# EAGLE design HeepTeensyBoard (EAGLE 7.3.0)
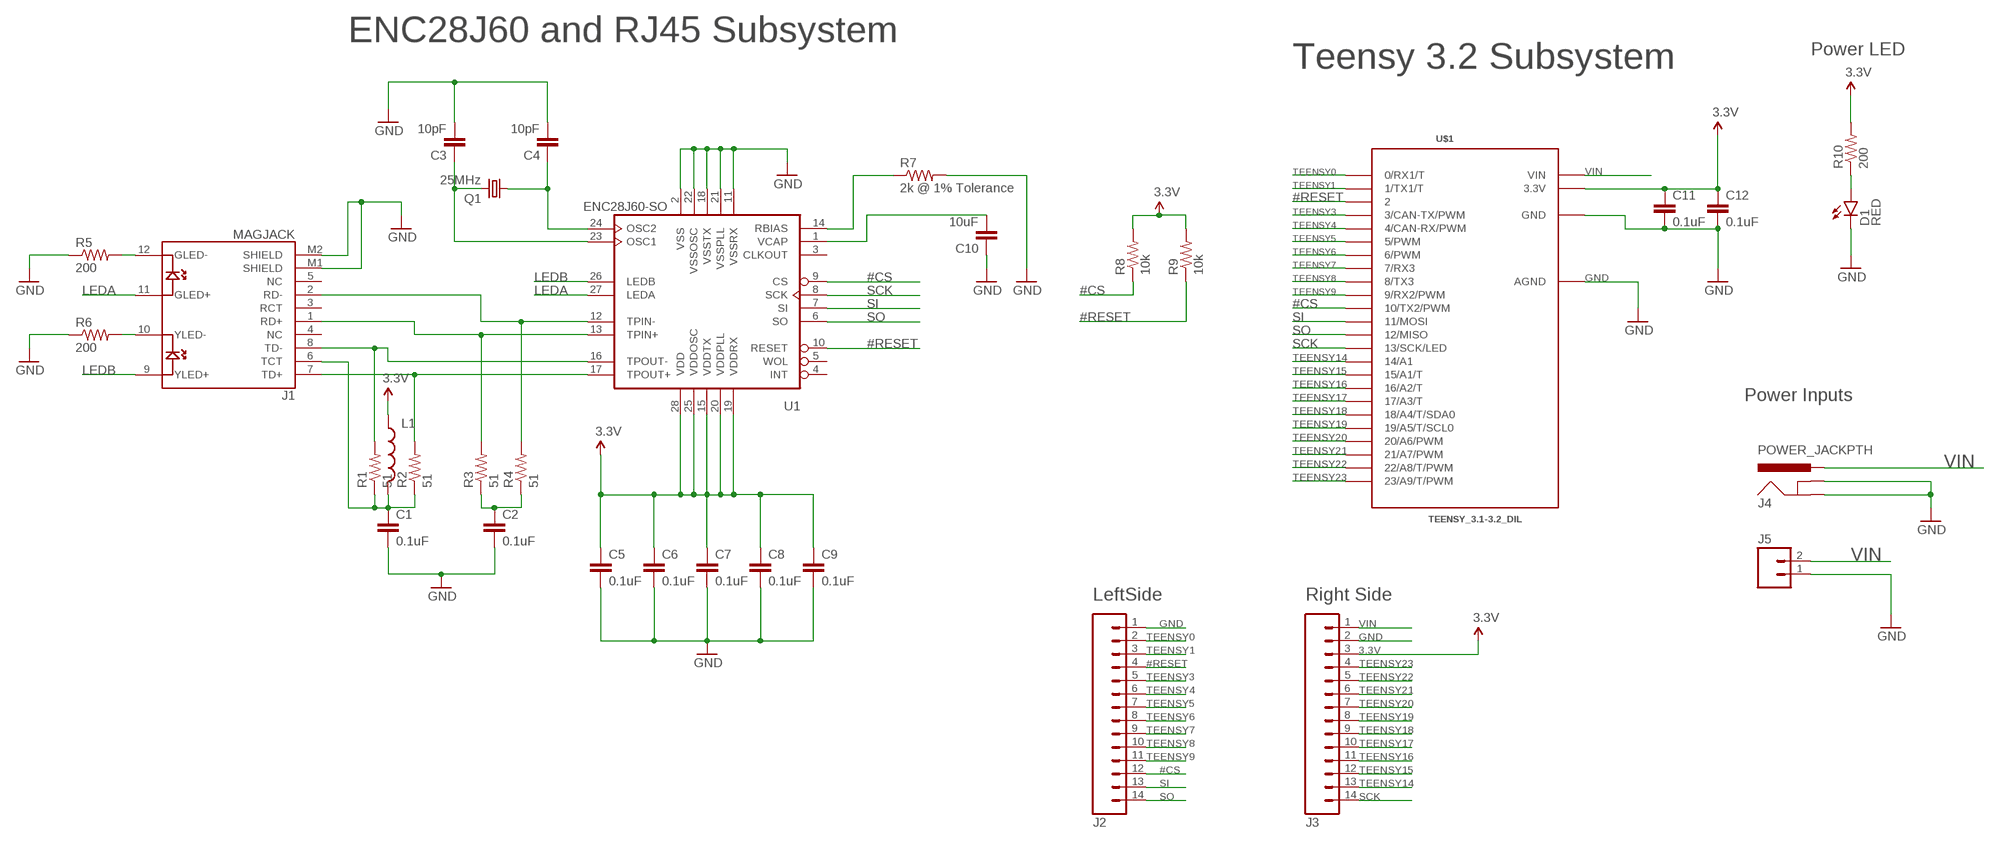
[diagram p0: schematic, sheet 1]

## Parts
C1  0.1uF  CAP0603-CAP  [0603-CAP]
C2  0.1uF  CAP0603-CAP  [0603-CAP]
C3  10pF  CAP0603-CAP  [0603-CAP]
C4  10pF  CAP0603-CAP  [0603-CAP]
C5  0.1uF  CAP0603-CAP  [0603-CAP]
C6  0.1uF  CAP0603-CAP  [0603-CAP]
C7  0.1uF  CAP0603-CAP  [0603-CAP]
C8  0.1uF  CAP0603-CAP  [0603-CAP]
C9  0.1uF  CAP0603-CAP  [0603-CAP]
C10  10uF  CAP0603-CAP  [0603-CAP]
C11  0.1uF  CAP0603-CAP  [0603-CAP]
C12  0.1uF  CAP0603-CAP  [0603-CAP]
D1  RED  LED-RED0603  [LED-0603]
J1  MAGJACK  [MAGJACK]
J2  M14  [1X14]
J3  M14  [1X14]
J4  POWER_JACKPTH  [POWER_JACK_PTH]
J5  M02PTH  [1X02]
L1  INDUCTOR0603  [0603]
Q1  25MHz  CRYSTALSM49  [SM49]
R1  51  RESISTOR0603  [0603-RES]
R2  51  RESISTOR0603  [0603-RES]
R3  51  RESISTOR0603  [0603-RES]
R4  51  RESISTOR0603  [0603-RES]
R5  200  RESISTOR0603  [0603-RES]
R6  200  RESISTOR0603  [0603-RES]
R7  2k @ 1% Tolerance  RESISTOR0603-RES  [0603-RES]
R8  10k  RESISTOR0603-RES  [0603-RES]
R9  10k  RESISTOR0603-RES  [0603-RES]
R10  200  RESISTOR0603-RES  [0603-RES]
U1  ENC28J60-SO  [SO28W]
U$1  TEENSY_3.1-3.2_DIL  [TEENSY_3.0-3.2&LC_DIL]

## Nets
3.3V: C5.1 C6.1 C7.1 C8.1 C9.1 C11.1 C12.1 J3.3 L1.1 R8.2 R9.2 R10.2 U1.15(VDDTX) U1.19(VDDRX) U1.20(VDDPLL) U1.25(VDDOSC) U1.28(VDD) U$1.3.3V
#CS: J2.12 R8.1 U1.9(CS) U$1.10(10/TX2/PWM)
#RESET: J2.4 R9.1 U1.10(RESET) U$1.2
GND: C1.2 C2.2 C3.2 C4.2 C5.2 C6.2 C7.2 C8.2 C9.2 C10.1 C11.2 C12.2 D1.C J1.M1(SHIELD) J1.M2(SHIELD) J2.1 J3.2 J4.GND J4.GNDBREAK J5.1 R5.1 R6.1 R7.2 U1.2(VSS) U1.11(VSSRX) U1.18(VSSTX) U1.21(VSSPLL) U1.22(VSSOSC) U$1.AGND U$1.GND
LEDA: J1.11(GLED+) U1.27(LEDA)
LEDB: J1.9(YLED+) U1.26(LEDB)
N$1: J1.1(RD+) R3.2 U1.13(TPIN+)
N$2: J1.2(RD-) R4.2 U1.12(TPIN-)
N$3: J1.8(TD-) R1.2 U1.16(TPOUT-)
N$4: J1.7(TD+) R2.2 U1.17(TPOUT+)
N$5: C2.1 R3.1 R4.1
N$6: J1.10(YLED-) R6.2
N$7: C1.1 J1.6(TCT) L1.2 R1.1 R2.1
N$8: D1.A R10.1
N$10: J1.12(GLED-) R5.2
N$12: C3.1 Q1.2 U1.23(OSC1)
N$13: C4.1 Q1.1 U1.24(OSC2)
N$15: R7.1 U1.14(RBIAS)
N$17: C10.2 U1.1(VCAP)
SCK: J3.14 U1.8(SCK) U$1.13(13/SCK/LED)
SI: J2.13 U1.7(SI) U$1.11(11/MOSI)
SO: J2.14 U1.6(SO) U$1.12(12/MISO)
TEENSY0: J2.2 U$1.0(0/RX1/T)
TEENSY1: J2.3 U$1.1(1/TX1/T)
TEENSY3: J2.5 U$1.3(3/CAN-TX/PWM)
TEENSY4: J2.6 U$1.4(4/CAN-RX/PWM)
TEENSY5: J2.7 U$1.5(5/PWM)
TEENSY6: J2.8 U$1.6(6/PWM)
TEENSY7: J2.9 U$1.7(7/RX3)
TEENSY8: J2.10 U$1.8(8/TX3)
TEENSY9: J2.11 U$1.9(9/RX2/PWM)
TEENSY14: J3.13 U$1.14/A0(14/A1)
TEENSY15: J3.12 U$1.15/A1(15/A1/T)
TEENSY16: J3.11 U$1.16/A2(16/A2/T)
TEENSY17: J3.10 U$1.17/A3(17/A3/T)
TEENSY18: J3.9 U$1.18/A4(18/A4/T/SDA0)
TEENSY19: J3.8 U$1.19/A5(19/A5/T/SCL0)
TEENSY20: J3.7 U$1.20/A6(20/A6/PWM)
TEENSY21: J3.6 U$1.21/A7(21/A7/PWM)
TEENSY22: J3.5 U$1.22/A8(22/A8/T/PWM)
TEENSY23: J3.4 U$1.23/A9(23/A9/T/PWM)
VIN: J3.1 J4.PWR J5.2 U$1.VIN
Unconnected: J1.3(RCT) J1.4(NC) J1.5(NC) U1.3(CLKOUT) U1.4(INT) U1.5(WOL)

## Notes on the sheet
- ENC28J60 and RJ45 Subsystem
- Power LED
- Teensy 3.2 Subsystem
- Power Inputs
- LeftSide | Right Side

## Library data of the parts
C1 C2 C5-C9 C11 C12 = SparkFun-Capacitors:CAP: Capacitor Standard 0603 ceramic capacitor, and 0.1" leaded capacitor.
C3 C4 C10 = SparkFun-Passives:CAP: Capacitor Standard 0603 ceramic capacitor, and 0.1" leaded capacitor.
D1 = SparkFun-LED:LED-RED: Assorted Red LEDs LilyPad 1206- DIO-09912 1206- DIO-00809 0603- DIO-00819 "SMART" means more efficient and expensive; PROD_ID: DIO-00819
J1 = SparkFun-Connectors:MAGJACK: MAGJACK: RJ-45 with LEDs This is a single port, RJ45 ethernet jacks with built in transformer (magnetics), status LEDs, and shielding. Here is the connector we sell at SparkFun: RJ45 Ethernet MagJack-Compatible <https://www.sparkfun.com/products/8534> (PRT-08534) Datasheet <http://www.sparkfun.com/datasheets/Prototyping/MagJack.pdf> It is used on this SparkFun product: SparkFun RJ45 MagJack Breakout <https://www.sparkfun.com/products/13021> (BOB-13021); PROD_ID: CONN-09556; SF_ID: PRT-08534
J2 J3 = SparkFun-Connectors:M14: Header 14 Standard 14-pin 0.1" header. Use with straight break away headers (SKU : PRT-00116), right angle break away headers (PRT-00553), swiss pins (PRT-00743), machine pins (PRT-00117), and female headers (PRT-00115).
J4 = SparkFun-Connectors:POWER_JACK: Power Jack This is the standard 5.5mm barrel jack for power. The PTH is the most common, proven, reliable, footprint. The Slot footprint only works if the mill layer is transmitted to the PCB fab house so be warned. Mating wall wart : TOL-00298 (and others); PROD_ID: CONN-08197
J5 = SparkFun-Connectors:M02: Standard 2-pin 0.1" header. Use with - straight break away headers ( PRT-00116) - right angle break away headers (PRT-00553) - swiss pins (PRT-00743) - machine pins (PRT-00117) - female headers (PRT-00115) Molex polarized connector foot print use with: PRT-08233 with associated crimp pins and housings. 2.54_SCREWTERM for use with PRT-10571. 3.5mm Screw Terminal footprints for PRT-08084 5mm Screw Terminal footprints for use with PRT-08432
L1 = SparkFun-Passives:INDUCTOR: Inductors Basic Inductor/Choke - 0603 and 1206. Footprints are not proven and vary greatly between part numbers. INDUCTOR POWER 3.3UH 4.0A SMD 0.197" L x 0.197" W x 0.177" H (5.00mm x 5.00mm x 4.50mm)
Q1 = adafruit:CRYSTAL: CRYSTAL; OC_FARNELL: unknown; OC_NEWARK: unknown
R1-R6 = SparkFun-Resistors:RESISTOR: Resistor Basic schematic elements and footprints for 0603, 1206, and PTH resistors.
R7-R10 = SparkFun-Passives:RESISTOR: Resistor Basic schematic elements and footprints for 0603, 1206, and PTH resistors.
U1 = microchip-enc28j60:ENC28J60-*: Microchip 10Mbit Eth. contoller with SPI interface
U$1 = Teensy_3_and_LC_Series_Boards_v1.4:TEENSY_3.1-3.2_DIL: Teensy 3.1 or 3.2 in a DIL Layout.

## Board
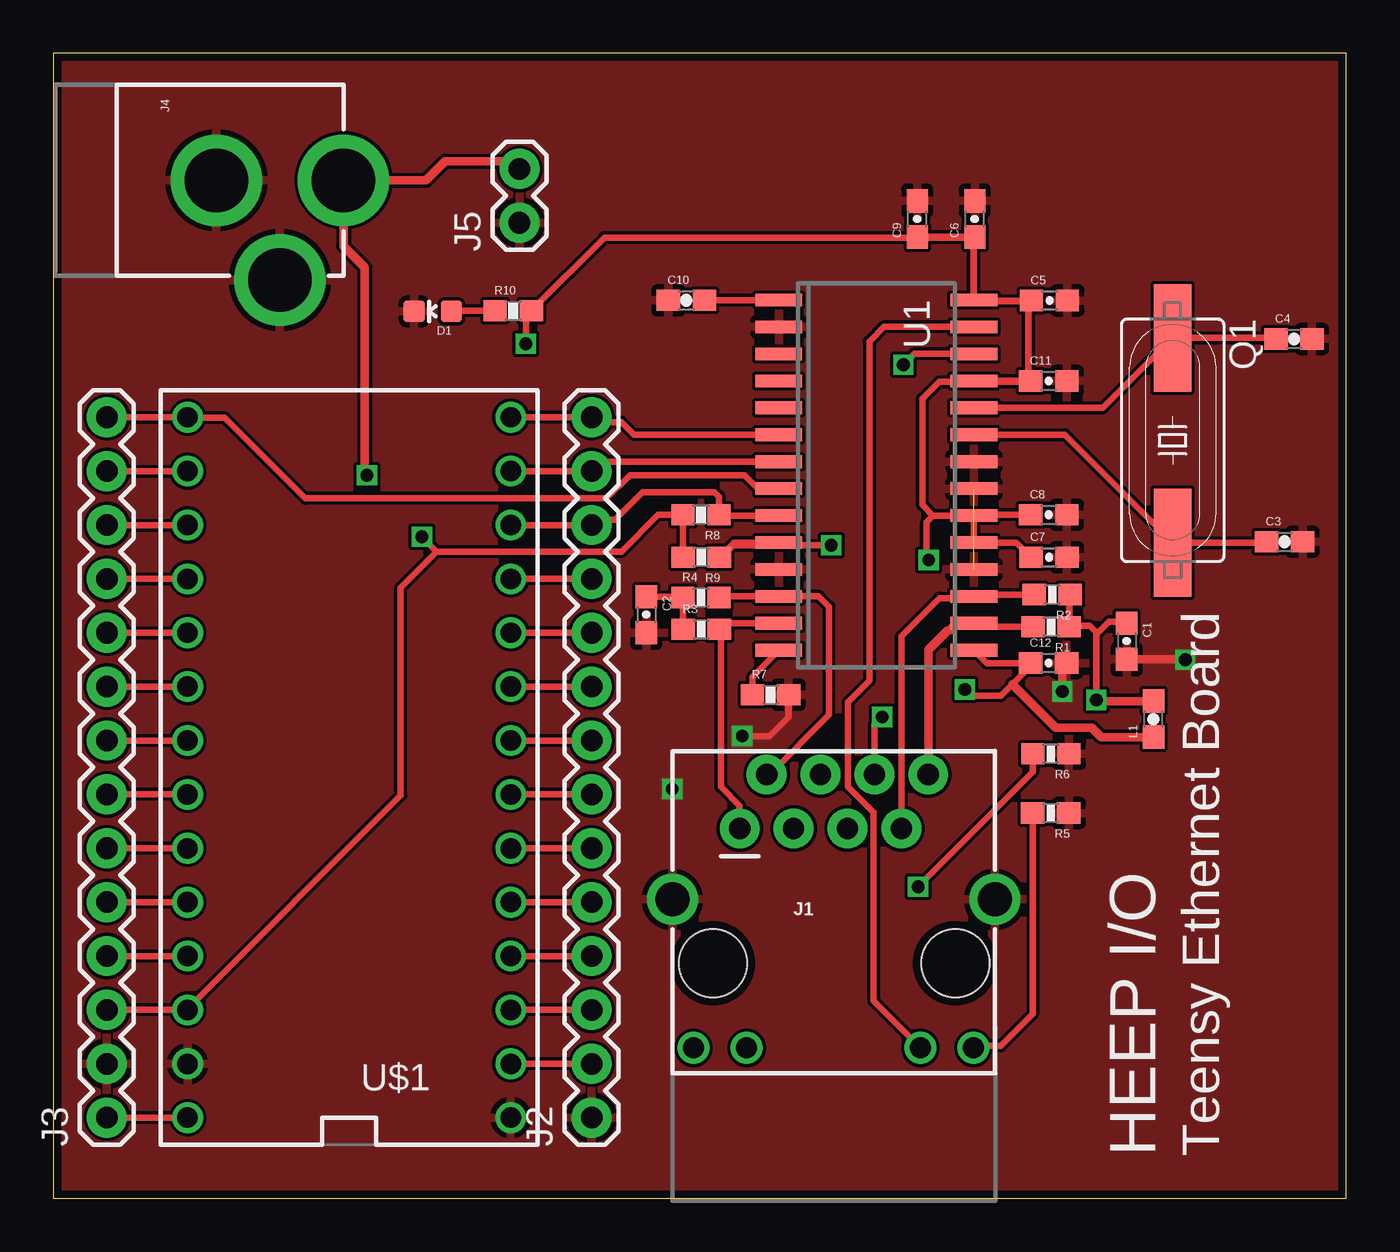
[diagram p1: board, top side]
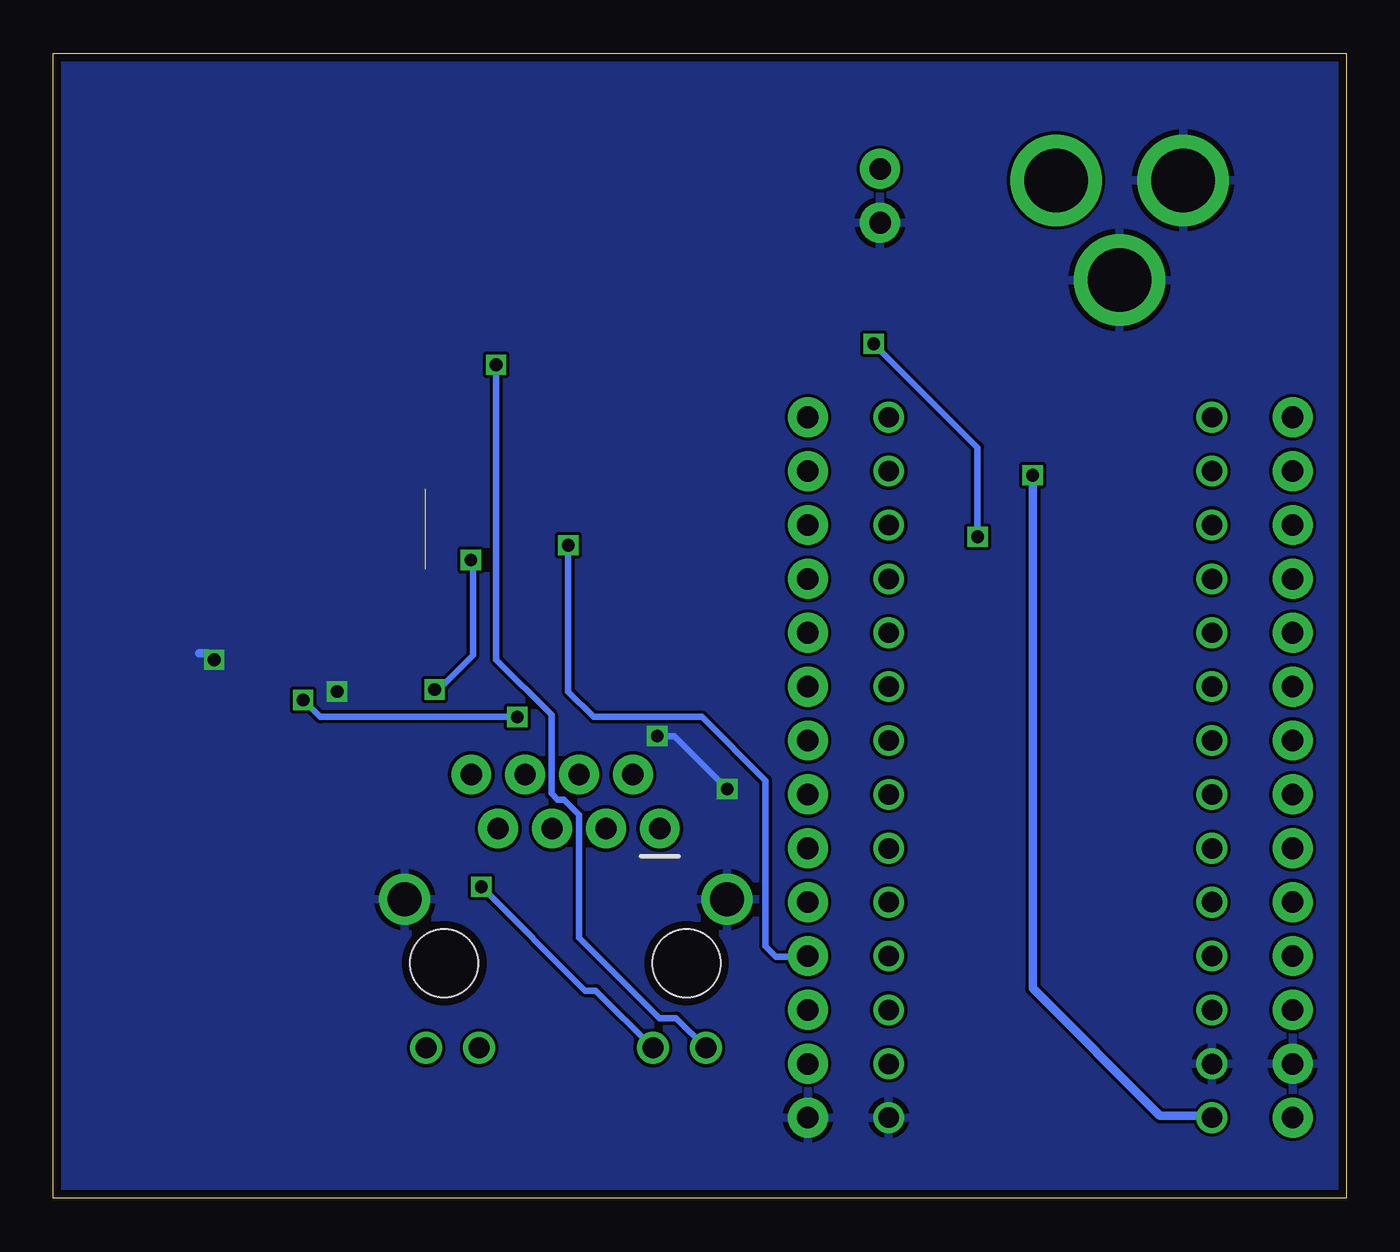
[diagram p2: board, bottom side, seen from below]

Size 61 x 54 mm. Coordinates in mm from the lower left corner, seen from the top.
Outline: 0,0 61,0 61,54 0,54 0,0
Copper layers (1*16): Top 0.0356mm / dielectric 1.5011mm / Bottom 0.0356mm
Design rules "LaenPCBOrder": minimum track width 6mil, minimum drill 13mil, track to track 6mil, track to pad 6mil, pad to pad 6mil, via to via 6mil, smd to smd 6mil, copper to edge 15mil, drill to drill 6mil, minimum pad ring 7mil, minimum via ring 7mil, stop-mask expansion 3mil, vias tented up to drill 0mil, thermal gap 10mil

### Footprints (pad centres in the part's own frame; a part is rotated, then mirrored left to right if it is on the bottom)
0603-CAP = smd 1.1 x 1: 1 -0.85,0; 2 0.85,0
LED-0603 = smd 1 x 1: A 0,-0.877; C 0,0.877
MAGJACK = drill 1 pad 1.88: 1 3.175,17.445; 2 4.445,19.985; 3 5.715,17.445; 4 6.985,19.985; 5 8.255,17.445; 6 9.525,19.985; 7 10.795,17.445; 8 12.065,19.985 | drill 1 pad 1.27: 9 1,7.1; 10 3.5,7.1; 11 11.7,7.1; 12 14.2,7.1 | drill 1.6 pad 2.184: M1 0,14.1; M2 15.2,14.1 | hole 3.2: 1.905,11.095; 13.335,11.095
1X14 = drill 1.016 pad 1.88: 1 0,0; 2 2.54,0; 3 5.08,0; 4 7.62,0; 5 10.16,0; 6 12.7,0; 7 15.24,0; 8 17.78,0; 9 20.32,0; 10 22.86,0; 11 25.4,0; 12 27.94,0; 13 30.48,0; 14 33.02,0
POWER_JACK_PTH = drill 2.997 pad 4.318: GND 0,7.7; GNDBREAK 4.7,10.7; PWR 0,13.7
1X02 = drill 1.016 pad 1.88: 1 0,0; 2 2.54,0
0603 = smd 1.1 x 1: 1 -0.85,0; 2 0.85,0
SM49 = smd 5.08 x 1.778: 1 -4.826,0; 2 4.826,0
0603-RES = smd 1.1 x 1: 1 -0.85,0; 2 0.85,0
SO28W = smd 0.6 x 2.2: 1 -8.255,-4.6; 2 -6.985,-4.6; 3 -5.715,-4.6; 4 -4.445,-4.6; 5 -3.175,-4.6; 6 -1.905,-4.6; 7 -0.635,-4.6; 8 0.635,-4.6; 9 1.905,-4.6; 10 3.175,-4.6; 11 4.445,-4.6; 12 5.715,-4.6; 13 6.985,-4.6; 14 8.255,-4.6; 15 8.255,4.6; 16 6.985,4.6; 17 5.715,4.6; 18 4.445,4.6; 19 3.175,4.6; 20 1.905,4.6; 21 0.635,4.6; 22 -0.635,4.6; 23 -1.905,4.6; 24 -3.175,4.6; 25 -4.445,4.6; 26 -5.715,4.6; 27 -6.985,4.6; 28 -8.255,4.6
TEENSY_3.0-3.2&LC_DIL = drill 0.965: 0 -7.62,13.97; 1 -7.62,11.43; 2 -7.62,8.89; 3 -7.62,6.35; 3.3V 7.62,11.43; 4 -7.62,3.81; 5 -7.62,1.27; 6 -7.62,-1.27; 7 -7.62,-3.81; 8 -7.62,-6.35; 9 -7.62,-8.89; 10 -7.62,-11.43; 11 -7.62,-13.97; 12 -7.62,-16.51; 13 7.62,-16.51; 14/A0 7.62,-13.97; 15/A1 7.62,-11.43; 16/A2 7.62,-8.89; 17/A3 7.62,-6.35; 18/A4 7.62,-3.81; 19/A5 7.62,-1.27; 20/A6 7.62,1.27; 21/A7 7.62,3.81; 22/A8 7.62,6.35; 23/A9 7.62,8.89; AGND 7.62,13.97; GND -7.62,16.51; VIN 7.62,16.51

### Placement (x,y rotation side)
C1  50.63,26.27 270 top
C2  27.98,27.52 270 top
C3  58.08,30.96 0 top
C4  58.52,40.52 0 top
C5  46.99,42.33 0 top
C6  43.47,46.18 90 top
C7  46.97,30.23 0 top
C8  46.96,32.23 0 top
C9  40.76,46.18 90 top
C10  29.87,42.34 0 top
C11  46.96,38.54 0 top
C12  46.95,25.24 0 top
D1  17.91,41.82 90 top
J1  29.21,0 0 top
J2  25.4,3.81 90 top
J3  2.54,3.81 90 top
J4  0,48 270 top
J5  22,46 90 top
L1  51.9,22.6 90 top
Q1  52.8,35.74 270 top
R1  47.07,26.95 180 top
R2  47.12,28.47 180 top
R3  30.57,26.83 0 top
R4  30.56,28.33 0 top
R5  47.05,18.17 180 top
R6  47.06,20.97 180 top
R7  33.84,23.75 0 top
R8  30.56,32.23 180 top
R9  30.57,30.23 180 top
R10  21.7,41.85 0 top
U1  38.83,34.1 270 top
U$1  13.97,20.32 180 top

### Tracks (layer width: path | path; a pad name or v marks a point on that pad's centre or on a via)
3.3V  (via drill 0.6)
  Top 0.305: R9.2 R8.2 28.53,32.23 26.8,30.5 18.1,30.5 | U1.15 44.03,25.24 C12.1 46.1,25.1 45.25,24.25 44.7,23.7 43.3,23.7 v43,24 | C8.1 43.47,32.23 U1.20 | C7.1 45.42,30.93 U1.19 U1.20 | C5.1 45.87,42.33 | C9.1 C6.1 43.43,45.29 U1.28 43.45,42.33 45.87,42.33 | 45.87,42.33 46,42.2 46,38.65 C11.1 U1.25 43.38,38.5 | U1.20 41.51,32.2 | 41.51,32.2 41,32.7 41,37.7 41.8,38.5 43.38,38.5 | v41.3,30.1 41.3,30.3 41.2,30.4 41.2,31.89 41.51,32.2 | J3.3 U$1.3.3V 6.35,8.95 16.4,19 16.4,28.8 18.1,30.5 | 18.1,30.5 v17.4,31.2 | v22.3,40.3 22.3,41.6 R10.2 26,45.3 43.5,45.3 43.4,45.2 43.4,42.4 43.5,42.3 46,42.3 46,38.5 43.38,38.5
  Top 0.406: L1.1 49.45,21.75 49,22.2 47.3,22.2 45.25,24.25
  Bottom 0.305: v43,24 42.8,24 41.2,25.6 41.2,30 v41.3,30.1 | v17.4,31.2 17.4,35.4 v22.3,40.3
#CS
  Top 0.305: U1.9 31.45,32.2 R8.1 31.41,33.09 31.2,33.3 27.8,33.3 26.5,32 25.65,32 J2.12 U$1.10
#RESET  (via drill 0.6)
  Top 0.305: U1.10 32.12,30.93 R9.1 31.42,30.02 31.3,29.9 31.3,30 32.1,30.8 v36.7,30.8 | J2.4 U$1.2
  Bottom 0.305: v36.7,30.8 36.7,23.9 35.5,22.7 30.4,22.7 27.4,19.7 27.4,11.9 26.9,11.4 25.43,11.4 J2.4
GND  (via drill 0.6)  (1 unrouted)
  Top 0.305: U1.11 33.85,29.66 33.8,29.6 | R7.2 34.69,22.69 33.8,21.8 v32.5,21.8 | v29.2,19.3 29,19.3
  Top 0.406: C1.2 53.38,25.42 v53.4,25.4 | C12.2 47.6,25.04 v47.6,23.9
  Bottom 0.305: v32.5,21.8 31.7,21.8 v29.2,19.3
  Bottom 0.406: v53.4,25.4 53.7,25.7 54.1,25.7 | v47.6,23.9 47.6,23.7
  pour Top: -8,86 108,86 108,37 108,-5 -17,-5 -17,86
  pour Bottom: -15,59 74,59 74,8 74,-4 -15,-4
LEDA
  Top 0.305: U1.27 39.19,41.09 38.5,40.4 38.5,24.4 37.5,23.4 37.5,19.4 38.7,18.2 38.7,9.31 J1.11
LEDB  (via drill 0.6)
  Top 0.305: U1.26 40.62,39.81 v40.1,39.3
  Bottom 0.305: v40.1,39.3 40.1,25.4 37.5,22.8 37.5,19.1 37.2,18.8 36.9,18.8 36.2,18.1 36.2,12.3 32.4,8.5 31.61,8.5 J1.9
N$1
  Top 0.305: J1.1 32.38,18.52 31.5,19.4 31.5,26.75 R3.2 31.7,27.11 U1.13
N$2
  Top 0.305: J1.2 33.78,19.98 36.6,22.8 36.6,27.9 36.1,28.4 34.24,28.4 U1.12 31.46,28.39 R4.2
N$3
  Top 0.305: R1.2 43.59,26.95 U1.16
  Top 0.406: J1.8 41.27,25.88 42.2,26.8 42.3,26.8 42.6,27.1 43.41,27.1 U1.16
N$4
  Top 0.305: J1.7 40.01,26.5 41.8,28.3 43.34,28.3 U1.17 43.52,28.47 R2.2
N$5
  Top 0.305: C2.1 29.67,28.37 R4.1 R3.1
N$6  (via drill 0.6)
  Top 0.305: R6.2 46.21,20.11 v40.8,14.7
  Bottom 0.305: v40.8,14.7 35.9,9.8 35.41,9.8 J1.10
N$7  (via drill 0.6)
  Top 0.305: J1.6 38.73,22.34 v39.1,22.7 | v49.2,23.5 49.2,26.7 | 49.2,26.7 48.9,27 47.97,27 R1.1 47.92,28.42 R2.1 | 49.2,26.7 49.3,26.7 49.8,27.2 50.55,27.2 C1.1
  Top 0.406: L1.2 49.2,23.45 v49.2,23.5
  Bottom 0.305: v39.1,22.7 48.4,22.7 v49.2,23.5
N$8
  Top 0.305: R10.1 18.82,41.85 D1.A
N$10
  Top 0.305: R5.2 46.2,8.7 44.7,7.2 43.51,7.2 J1.12
N$12
  Top 0.305: U1.23 47.71,36.01 Q1.2 57.18,30.91 C3.1
N$13
  Top 0.305: U1.24 49.51,37.27 Q1.1 57.62,40.57 C4.1
N$15
  Top 0.305: R7.1 32.99,24.61 U1.14
N$17
  Top 0.305: U1.1 30.73,42.35 C10.2
SCK
  Top 0.305: U1.8 33.23,33.47 32.6,34.1 27.2,34.1 26.1,33 11.9,33 8.1,36.8 6.38,36.8 U$1.13 J3.14
SI
  Top 0.305: U1.7 25.84,34.73 J2.13 U$1.11
SO
  Top 0.305: U1.6 27.39,36.01 26.8,36.6 25.63,36.6 J2.14 U$1.12
TEENSY0
  Top 0.305: J2.2 U$1.0
TEENSY1
  Top 0.305: J2.3 U$1.1
TEENSY3
  Top 0.305: J2.5 U$1.3
TEENSY4
  Top 0.305: J2.6 U$1.4
TEENSY5
  Top 0.305: J2.7 U$1.5
TEENSY6
  Top 0.305: J2.8 U$1.6
TEENSY7
  Top 0.305: J2.9 U$1.7
TEENSY8
  Top 0.305: J2.10 U$1.8
TEENSY9
  Top 0.305: J2.11 U$1.9
TEENSY14
  Top 0.305: J3.13 U$1.14/A0
TEENSY15
  Top 0.305: J3.12 U$1.15/A1
TEENSY16
  Top 0.305: J3.11 U$1.16/A2
TEENSY17
  Top 0.305: J3.10 U$1.17/A3
TEENSY18
  Top 0.305: U$1.18/A4 J3.9
TEENSY19
  Top 0.305: U$1.19/A5 J3.8
TEENSY20
  Top 0.305: U$1.20/A6 J3.7
TEENSY21
  Top 0.305: U$1.21/A7 J3.6
TEENSY22
  Top 0.305: U$1.22/A8 J3.5
TEENSY23
  Top 0.305: U$1.23/A9 J3.4
VIN  (via drill 0.6)
  Top 0.305: U$1.VIN J3.1
  Top 0.406: J5.2 21.64,48.9 18.5,48.9 17.6,48 J4.PWR 13.7,44.9 14.7,43.9 14.7,34.2 v14.8,34.1
  Bottom 0.406: v14.8,34.1 14.8,9.9 8.8,3.9 6.44,3.9 U$1.VIN

### Text on the board
tPlace: HEEP I/O | Teensy Ethernet Board